# Altium schematic sheet Signals.SchDoc
size A4
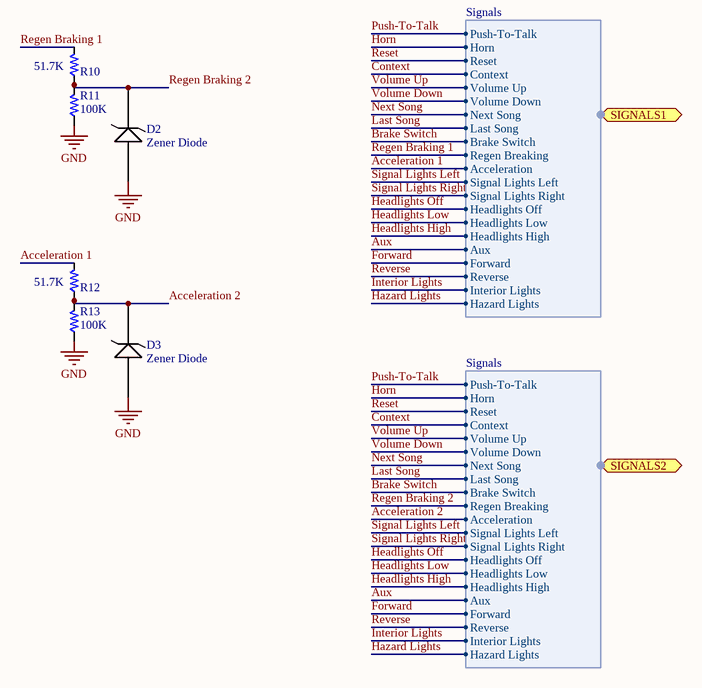
[diagram p0: Signals.SchDoc]

## Parts
D2  Zener Diode  [PCBComponent_1]
D3  Zener Diode  [PCBComponent_1]
R10  Resistance: 51.7K  [PCB_GENERIC_SMD_0603]  (hidden comment: SCH_GENERIC_RESISTOR_0603)
R11  value 100K  [PCB_GENERIC_SMD_0603]  (hidden comment: R060-00104-05)
R12  Resistance: 51.7K  [PCB_GENERIC_SMD_0603]  (hidden comment: SCH_GENERIC_RESISTOR_0603)
R13  value 100K  [PCB_GENERIC_SMD_0603]  (hidden comment: R060-00104-05)

## Ports
SIGNALS1 (harness Signals), SIGNALS2 (harness Signals)

## Harnesses
Signals: Push-To-Talk, Horn, Reset, Context, Volume Up, Volume Down, Next Song, Last Song, Brake Switch, Regen Breaking, Acceleration, Signal Lights Left, Signal Lights Right, Headlights Off, Headlights Low, Headlights High, Aux, Forward, Reverse, Interior Lights, Hazard Lights

## Nets
GND: D2.2 D3.2
Acceleration 1: R12.2 ; port SIGNALS1.Acceleration
Acceleration 2: D3.1 R12.1 R13.2 ; port SIGNALS2.Acceleration
Aux: port SIGNALS1.Aux, port SIGNALS2.Aux
Brake Switch: port SIGNALS1.Brake Switch, port SIGNALS2.Brake Switch
Context: port SIGNALS1.Context, port SIGNALS2.Context
Forward: port SIGNALS1.Forward, port SIGNALS2.Forward
Hazard Lights: port SIGNALS1.Hazard Lights, port SIGNALS2.Hazard Lights
Headlights High: port SIGNALS1.Headlights High, port SIGNALS2.Headlights High
Headlights Low: port SIGNALS1.Headlights Low, port SIGNALS2.Headlights Low
Headlights Off: port SIGNALS1.Headlights Off, port SIGNALS2.Headlights Off
Horn: port SIGNALS1.Horn, port SIGNALS2.Horn
Interior Lights: port SIGNALS1.Interior Lights, port SIGNALS2.Interior Lights
Last Song: port SIGNALS1.Last Song, port SIGNALS2.Last Song
Next Song: port SIGNALS1.Next Song, port SIGNALS2.Next Song
Push-To-Talk: port SIGNALS1.Push-To-Talk, port SIGNALS2.Push-To-Talk
Regen Braking 1: R10.2 ; port SIGNALS1.Regen Breaking
Regen Braking 2: D2.1 R10.1 R11.2 ; port SIGNALS2.Regen Breaking
Reset: port SIGNALS1.Reset, port SIGNALS2.Reset
Reverse: port SIGNALS1.Reverse, port SIGNALS2.Reverse
Signal Lights Left: port SIGNALS1.Signal Lights Left, port SIGNALS2.Signal Lights Left
Signal Lights Right: port SIGNALS1.Signal Lights Right, port SIGNALS2.Signal Lights Right
Volume Down: port SIGNALS1.Volume Down, port SIGNALS2.Volume Down
Volume Up: port SIGNALS1.Volume Up, port SIGNALS2.Volume Up

Not connected (* = marked no-connect by the designer): R11 1; R13 1

## Notes on the sheet
- Labels drawn without touching a wire or pin: GND

## Library data of the parts
D2 D3 = ON Semi Schottky Diode - MBRM110LT1G
R10 R12 = SCH_GENERIC_RESISTOR_0603: Generic SMD resistor 0603
R11 R13 = R060-00104-05: RES 0603 100K 5% 63mW; Tolerance: 5%; Power: 63mW; Package: 0603